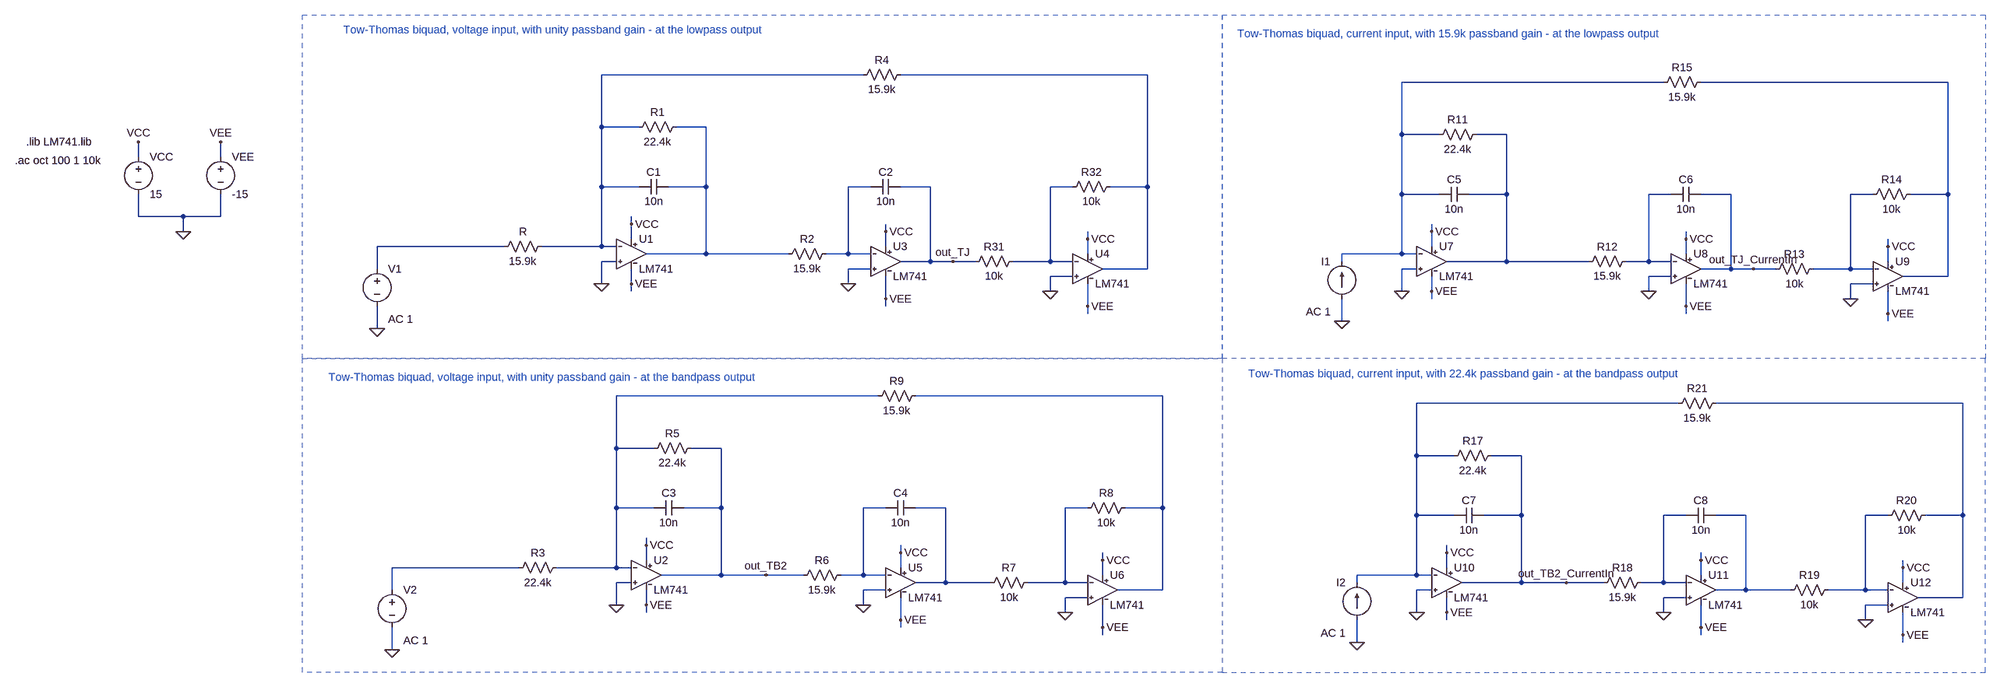
[diagram p0: schematic Filtre_Tow_Thomas.asc]
Filtre_Tow_Thomas.asc, the LTspice schematic file:
Version 4
SHEET 1 3924 1332
WIRE 1520 48 960 48
WIRE 2128 48 1600 48
WIRE 3232 64 2672 64
WIRE 3840 64 3312 64
WIRE 960 160 960 48
WIRE 1040 160 960 160
WIRE 1184 160 1120 160
WIRE 2672 176 2672 64
WIRE 2752 176 2672 176
WIRE 2896 176 2832 176
WIRE -144 224 -144 192
WIRE 32 224 32 192
WIRE 960 288 960 160
WIRE 1040 288 960 288
WIRE 1184 288 1184 160
WIRE 1184 288 1104 288
WIRE 1536 288 1488 288
WIRE 1664 288 1600 288
WIRE 1968 288 1920 288
WIRE 2128 288 2128 48
WIRE 2128 288 2048 288
WIRE 2672 304 2672 176
WIRE 2752 304 2672 304
WIRE 2896 304 2896 176
WIRE 2896 304 2816 304
WIRE 3248 304 3200 304
WIRE 3376 304 3312 304
WIRE 3680 304 3632 304
WIRE 3840 304 3840 64
WIRE 3840 304 3760 304
WIRE -144 352 -144 304
WIRE -48 352 -144 352
WIRE 32 352 32 304
WIRE 32 352 -48 352
WIRE 1024 368 1024 352
WIRE -48 384 -48 352
WIRE 1568 384 1568 368
WIRE 2736 384 2736 368
WIRE 1024 400 1024 368
WIRE 2000 400 2000 384
WIRE 3280 400 3280 384
WIRE 752 416 480 416
WIRE 960 416 960 288
WIRE 960 416 832 416
WIRE 992 416 960 416
WIRE 1568 416 1568 384
WIRE 2736 416 2736 384
WIRE 3712 416 3712 400
WIRE 1184 432 1184 288
WIRE 1184 432 1056 432
WIRE 1360 432 1184 432
WIRE 1488 432 1488 288
WIRE 1488 432 1440 432
WIRE 1536 432 1488 432
WIRE 2000 432 2000 400
WIRE 2672 432 2672 304
WIRE 2672 432 2544 432
WIRE 2704 432 2672 432
WIRE 3280 432 3280 400
WIRE 992 448 960 448
WIRE 1664 448 1664 288
WIRE 1664 448 1600 448
WIRE 1712 448 1664 448
WIRE 1760 448 1712 448
WIRE 1920 448 1920 288
WIRE 1920 448 1840 448
WIRE 1968 448 1920 448
WIRE 2544 448 2544 432
WIRE 2896 448 2896 304
WIRE 2896 448 2768 448
WIRE 3072 448 2896 448
WIRE 3200 448 3200 304
WIRE 3200 448 3152 448
WIRE 3248 448 3200 448
WIRE 3712 448 3712 416
WIRE 480 464 480 416
WIRE 1536 464 1488 464
WIRE 2128 464 2128 288
WIRE 2128 464 2032 464
WIRE 2704 464 2672 464
WIRE 3376 464 3376 304
WIRE 3376 464 3312 464
WIRE 3424 464 3376 464
WIRE 3472 464 3424 464
WIRE 3632 464 3632 304
WIRE 3632 464 3552 464
WIRE 3680 464 3632 464
WIRE 1968 480 1920 480
WIRE 3248 480 3200 480
WIRE 3840 480 3840 304
WIRE 3840 480 3744 480
WIRE 960 496 960 448
WIRE 1024 496 1024 464
WIRE 1488 496 1488 464
WIRE 3680 496 3632 496
WIRE 1024 512 1024 496
WIRE 1920 512 1920 480
WIRE 2672 512 2672 464
WIRE 2736 512 2736 480
WIRE 3200 512 3200 480
WIRE 1568 528 1568 480
WIRE 2736 528 2736 512
WIRE 3632 528 3632 496
WIRE 1568 544 1568 528
WIRE 2000 544 2000 496
WIRE 3280 544 3280 496
WIRE 2000 560 2000 544
WIRE 3280 560 3280 544
WIRE 3712 560 3712 512
WIRE 2544 576 2544 528
WIRE 3712 576 3712 560
WIRE 480 592 480 544
WIRE 1552 736 992 736
WIRE 2160 736 1632 736
WIRE 3264 752 2704 752
WIRE 3872 752 3344 752
WIRE 992 848 992 736
WIRE 1072 848 992 848
WIRE 1216 848 1152 848
WIRE 2704 864 2704 752
WIRE 2784 864 2704 864
WIRE 2928 864 2864 864
WIRE 992 976 992 848
WIRE 1072 976 992 976
WIRE 1216 976 1216 848
WIRE 1216 976 1136 976
WIRE 1568 976 1520 976
WIRE 1696 976 1632 976
WIRE 2000 976 1952 976
WIRE 2160 976 2160 736
WIRE 2160 976 2080 976
WIRE 2704 992 2704 864
WIRE 2784 992 2704 992
WIRE 2928 992 2928 864
WIRE 2928 992 2848 992
WIRE 3280 992 3232 992
WIRE 3408 992 3344 992
WIRE 3712 992 3664 992
WIRE 3872 992 3872 752
WIRE 3872 992 3792 992
WIRE 1056 1056 1056 1040
WIRE 1600 1072 1600 1056
WIRE 2768 1072 2768 1056
WIRE 1056 1088 1056 1056
WIRE 2032 1088 2032 1072
WIRE 3312 1088 3312 1072
WIRE 784 1104 512 1104
WIRE 992 1104 992 976
WIRE 992 1104 864 1104
WIRE 1024 1104 992 1104
WIRE 1600 1104 1600 1072
WIRE 2768 1104 2768 1072
WIRE 3744 1104 3744 1088
WIRE 1216 1120 1216 976
WIRE 1216 1120 1088 1120
WIRE 1312 1120 1216 1120
WIRE 1392 1120 1312 1120
WIRE 1520 1120 1520 976
WIRE 1520 1120 1472 1120
WIRE 1568 1120 1520 1120
WIRE 2032 1120 2032 1088
WIRE 2704 1120 2704 992
WIRE 2704 1120 2576 1120
WIRE 2736 1120 2704 1120
WIRE 3312 1120 3312 1088
WIRE 1024 1136 992 1136
WIRE 1696 1136 1696 976
WIRE 1696 1136 1632 1136
WIRE 1792 1136 1696 1136
WIRE 1952 1136 1952 976
WIRE 1952 1136 1872 1136
WIRE 2000 1136 1952 1136
WIRE 2576 1136 2576 1120
WIRE 2928 1136 2928 992
WIRE 2928 1136 2800 1136
WIRE 3024 1136 2928 1136
WIRE 3104 1136 3024 1136
WIRE 3232 1136 3232 992
WIRE 3232 1136 3184 1136
WIRE 3280 1136 3232 1136
WIRE 3744 1136 3744 1104
WIRE 512 1152 512 1104
WIRE 1568 1152 1520 1152
WIRE 2160 1152 2160 976
WIRE 2160 1152 2064 1152
WIRE 2736 1152 2704 1152
WIRE 3408 1152 3408 992
WIRE 3408 1152 3344 1152
WIRE 3504 1152 3408 1152
WIRE 3664 1152 3664 992
WIRE 3664 1152 3584 1152
WIRE 3712 1152 3664 1152
WIRE 2000 1168 1952 1168
WIRE 3280 1168 3232 1168
WIRE 3872 1168 3872 992
WIRE 3872 1168 3776 1168
WIRE 992 1184 992 1136
WIRE 1056 1184 1056 1152
WIRE 1520 1184 1520 1152
WIRE 3712 1184 3664 1184
WIRE 1056 1200 1056 1184
WIRE 1952 1200 1952 1168
WIRE 2704 1200 2704 1152
WIRE 2768 1200 2768 1168
WIRE 3232 1200 3232 1168
WIRE 1600 1216 1600 1168
WIRE 2768 1216 2768 1200
WIRE 3664 1216 3664 1184
WIRE 1600 1232 1600 1216
WIRE 2032 1232 2032 1184
WIRE 3312 1232 3312 1184
WIRE 2032 1248 2032 1232
WIRE 3312 1248 3312 1232
WIRE 3744 1248 3744 1200
WIRE 2576 1264 2576 1216
WIRE 3744 1264 3744 1248
WIRE 512 1280 512 1232
FLAG -144 192 VCC
FLAG 32 192 VEE
FLAG 960 496 0
FLAG 1488 496 0
FLAG 1920 512 0
FLAG 480 592 0
FLAG -48 384 0
FLAG 1024 368 VCC
FLAG 1568 384 VCC
FLAG 2000 400 VCC
FLAG 1024 496 VEE
FLAG 1568 528 VEE
FLAG 2000 544 VEE
FLAG 1712 448 out_TJ
FLAG 992 1184 0
FLAG 1520 1184 0
FLAG 1952 1200 0
FLAG 512 1280 0
FLAG 1056 1056 VCC
FLAG 1600 1072 VCC
FLAG 2032 1088 VCC
FLAG 1056 1184 VEE
FLAG 1600 1216 VEE
FLAG 2032 1232 VEE
FLAG 1312 1120 out_TB2
FLAG 2672 512 0
FLAG 3200 512 0
FLAG 3632 528 0
FLAG 2736 384 VCC
FLAG 3280 400 VCC
FLAG 3712 416 VCC
FLAG 2736 512 VEE
FLAG 3280 544 VEE
FLAG 3712 560 VEE
FLAG 3424 464 out_TJ_CurrentIn
FLAG 2704 1200 0
FLAG 3232 1200 0
FLAG 3664 1216 0
FLAG 2768 1072 VCC
FLAG 3312 1088 VCC
FLAG 3744 1104 VCC
FLAG 2768 1200 VEE
FLAG 3312 1232 VEE
FLAG 3744 1248 VEE
FLAG 3024 1136 out_TB2_CurrentIn
FLAG 2544 576 0
FLAG 2576 1264 0
SYMBOL LM741 1024 368 R0
SYMATTR InstName U1
SYMBOL voltage -144 208 R0
WINDOW 123 0 0 Left 2
WINDOW 39 0 0 Left 2
SYMATTR InstName VCC
SYMATTR Value 15
SYMBOL voltage 32 208 R0
WINDOW 123 0 0 Left 2
WINDOW 39 0 0 Left 2
SYMATTR InstName VEE
SYMATTR Value -15
SYMBOL res 848 400 R90
WINDOW 0 0 56 VBottom 2
WINDOW 3 32 56 VTop 2
SYMATTR InstName R
SYMATTR Value 15.9k
SYMBOL res 1136 144 R90
WINDOW 0 0 56 VBottom 2
WINDOW 3 32 56 VTop 2
SYMATTR InstName R1
SYMATTR Value 22.4k
SYMBOL res 1456 416 R90
WINDOW 0 0 56 VBottom 2
WINDOW 3 32 56 VTop 2
SYMATTR InstName R2
SYMATTR Value 15.9k
SYMBOL res 1856 432 R90
WINDOW 0 0 56 VBottom 2
WINDOW 3 32 56 VTop 2
SYMATTR InstName R31
SYMATTR Value 10k
SYMBOL res 2064 272 R90
WINDOW 0 0 56 VBottom 2
WINDOW 3 32 56 VTop 2
SYMATTR InstName R32
SYMATTR Value 10k
SYMBOL LM741 1568 384 R0
SYMATTR InstName U3
SYMBOL LM741 2000 400 R0
SYMATTR InstName U4
SYMBOL cap 1104 272 R90
WINDOW 0 0 32 VBottom 2
WINDOW 3 32 32 VTop 2
SYMATTR InstName C1
SYMATTR Value 10n
SYMBOL cap 1600 272 R90
WINDOW 0 0 32 VBottom 2
WINDOW 3 32 32 VTop 2
SYMATTR InstName C2
SYMATTR Value 10n
SYMBOL voltage 480 448 R0
WINDOW 123 24 124 Left 2
WINDOW 39 0 0 Left 0
SYMATTR Value2 AC 1
SYMATTR InstName V1
SYMATTR Value ""
SYMBOL res 1616 32 R90
WINDOW 0 0 56 VBottom 2
WINDOW 3 32 56 VTop 2
SYMATTR InstName R4
SYMATTR Value 15.9k
SYMBOL LM741 1056 1056 R0
SYMATTR InstName U2
SYMBOL res 880 1088 R90
WINDOW 0 0 56 VBottom 2
WINDOW 3 32 56 VTop 2
SYMATTR InstName R3
SYMATTR Value 22.4k
SYMBOL res 1168 832 R90
WINDOW 0 0 56 VBottom 2
WINDOW 3 32 56 VTop 2
SYMATTR InstName R5
SYMATTR Value 22.4k
SYMBOL res 1488 1104 R90
WINDOW 0 0 56 VBottom 2
WINDOW 3 32 56 VTop 2
SYMATTR InstName R6
SYMATTR Value 15.9k
SYMBOL res 1888 1120 R90
WINDOW 0 0 56 VBottom 2
WINDOW 3 32 56 VTop 2
SYMATTR InstName R7
SYMATTR Value 10k
SYMBOL res 2096 960 R90
WINDOW 0 0 56 VBottom 2
WINDOW 3 32 56 VTop 2
SYMATTR InstName R8
SYMATTR Value 10k
SYMBOL LM741 1600 1072 R0
SYMATTR InstName U5
SYMBOL LM741 2032 1088 R0
SYMATTR InstName U6
SYMBOL cap 1136 960 R90
WINDOW 0 0 32 VBottom 2
WINDOW 3 32 32 VTop 2
SYMATTR InstName C3
SYMATTR Value 10n
SYMBOL cap 1632 960 R90
WINDOW 0 0 32 VBottom 2
WINDOW 3 32 32 VTop 2
SYMATTR InstName C4
SYMATTR Value 10n
SYMBOL voltage 512 1136 R0
WINDOW 123 24 124 Left 2
WINDOW 39 0 0 Left 0
SYMATTR Value2 AC 1
SYMATTR InstName V2
SYMATTR Value ""
SYMBOL res 1648 720 R90
WINDOW 0 0 56 VBottom 2
WINDOW 3 32 56 VTop 2
SYMATTR InstName R9
SYMATTR Value 15.9k
SYMBOL LM741 2736 384 R0
SYMATTR InstName U7
SYMBOL res 2848 160 R90
WINDOW 0 0 56 VBottom 2
WINDOW 3 32 56 VTop 2
SYMATTR InstName R11
SYMATTR Value 22.4k
SYMBOL res 3168 432 R90
WINDOW 0 0 56 VBottom 2
WINDOW 3 32 56 VTop 2
SYMATTR InstName R12
SYMATTR Value 15.9k
SYMBOL res 3568 448 R90
WINDOW 0 0 56 VBottom 2
WINDOW 3 32 56 VTop 2
SYMATTR InstName R13
SYMATTR Value 10k
SYMBOL res 3776 288 R90
WINDOW 0 0 56 VBottom 2
WINDOW 3 32 56 VTop 2
SYMATTR InstName R14
SYMATTR Value 10k
SYMBOL LM741 3280 400 R0
SYMATTR InstName U8
SYMBOL LM741 3712 416 R0
SYMATTR InstName U9
SYMBOL cap 2816 288 R90
WINDOW 0 0 32 VBottom 2
WINDOW 3 32 32 VTop 2
SYMATTR InstName C5
SYMATTR Value 10n
SYMBOL cap 3312 288 R90
WINDOW 0 0 32 VBottom 2
WINDOW 3 32 32 VTop 2
SYMATTR InstName C6
SYMATTR Value 10n
SYMBOL res 3328 48 R90
WINDOW 0 0 56 VBottom 2
WINDOW 3 32 56 VTop 2
SYMATTR InstName R15
SYMATTR Value 15.9k
SYMBOL LM741 2768 1072 R0
SYMATTR InstName U10
SYMBOL res 2880 848 R90
WINDOW 0 0 56 VBottom 2
WINDOW 3 32 56 VTop 2
SYMATTR InstName R17
SYMATTR Value 22.4k
SYMBOL res 3200 1120 R90
WINDOW 0 0 56 VBottom 2
WINDOW 3 32 56 VTop 2
SYMATTR InstName R18
SYMATTR Value 15.9k
SYMBOL res 3600 1136 R90
WINDOW 0 0 56 VBottom 2
WINDOW 3 32 56 VTop 2
SYMATTR InstName R19
SYMATTR Value 10k
SYMBOL res 3808 976 R90
WINDOW 0 0 56 VBottom 2
WINDOW 3 32 56 VTop 2
SYMATTR InstName R20
SYMATTR Value 10k
SYMBOL LM741 3312 1088 R0
SYMATTR InstName U11
SYMBOL LM741 3744 1104 R0
SYMATTR InstName U12
SYMBOL cap 2848 976 R90
WINDOW 0 0 32 VBottom 2
WINDOW 3 32 32 VTop 2
SYMATTR InstName C7
SYMATTR Value 10n
SYMBOL cap 3344 976 R90
WINDOW 0 0 32 VBottom 2
WINDOW 3 32 32 VTop 2
SYMATTR InstName C8
SYMATTR Value 10n
SYMBOL res 3360 736 R90
WINDOW 0 0 56 VBottom 2
WINDOW 3 32 56 VTop 2
SYMATTR InstName R21
SYMATTR Value 15.9k
SYMBOL current 2544 528 R180
WINDOW 0 24 80 Left 2
WINDOW 3 24 0 Left 2
WINDOW 123 24 -28 Left 2
WINDOW 39 0 0 Left 0
SYMATTR InstName I1
SYMATTR Value ""
SYMATTR Value2 AC 1
SYMBOL current 2576 1216 R180
WINDOW 0 24 80 Left 2
WINDOW 3 24 0 Left 2
WINDOW 123 24 -28 Left 2
WINDOW 39 0 0 Left 0
SYMATTR InstName I2
SYMATTR Value ""
SYMATTR Value2 AC 1
TEXT -384 192 Left 2 !.lib LM741.lib
TEXT -408 232 Left 2 !.ac oct 100 1 10k
TEXT 408 -48 Left 2 ;Tow-Thomas biquad, voltage input, with unity passband gain - at the lowpass output
TEXT 376 696 Left 2 ;Tow-Thomas biquad, voltage input, with unity passband gain - at the bandpass output
TEXT 2320 -40 Left 2 ;Tow-Thomas biquad, current input, with 15.9k passband gain - at the lowpass output
TEXT 2344 688 Left 2 ;Tow-Thomas biquad, current input, with 22.4k passband gain - at the bandpass output
RECTANGLE Normal 2288 656 320 -80 2
RECTANGLE Normal 2288 1328 320 656 2
RECTANGLE Normal 3920 656 2288 -80 2
RECTANGLE Normal 2288 1328 3920 656 2

The netlist it stands for:
* Filtre_Tow_Thomas.asc
XU1 0 N001 VCC VEE N005 LM741  ; pins In+ In- V+ V- OUT
VCC VCC 0 15
VEE VEE 0 -15
R N001 N011 15.9k
R1 N005 N001 22.4k
R2 N007 N005 15.9k
R31 N008 out_TJ 10k
R32 N002 N008 10k
XU3 0 N007 VCC VEE out_TJ LM741  ; pins In+ In- V+ V- OUT
XU4 0 N008 VCC VEE N002 LM741  ; pins In+ In- V+ V- OUT
C1 N005 N001 10n
C2 out_TJ N007 10n
V1 N011 0 AC 1
R4 N002 N001 15.9k
XU2 0 N012 VCC VEE out_TB2 LM741  ; pins In+ In- V+ V- OUT
R3 N012 N022 22.4k
R5 out_TB2 N012 22.4k
R6 N016 out_TB2 15.9k
R7 N018 N017 10k
R8 N013 N018 10k
XU5 0 N016 VCC VEE N017 LM741  ; pins In+ In- V+ V- OUT
XU6 0 N018 VCC VEE N013 LM741  ; pins In+ In- V+ V- OUT
C3 out_TB2 N012 10n
C4 N017 N016 10n
V2 N022 0 AC 1
R9 N013 N012 15.9k
XU7 0 N003 VCC VEE N006 LM741  ; pins In+ In- V+ V- OUT
R11 N006 N003 22.4k
R12 N009 N006 15.9k
R13 N010 out_TJ_CurrentIn 10k
R14 N004 N010 10k
XU8 0 N009 VCC VEE out_TJ_CurrentIn LM741  ; pins In+ In- V+ V- OUT
XU9 0 N010 VCC VEE N004 LM741  ; pins In+ In- V+ V- OUT
C5 N006 N003 10n
C6 out_TJ_CurrentIn N009 10n
R15 N004 N003 15.9k
XU10 0 N014 VCC VEE out_TB2_CurrentIn LM741  ; pins In+ In- V+ V- OUT
R17 out_TB2_CurrentIn N014 22.4k
R18 N019 out_TB2_CurrentIn 15.9k
R19 N021 N020 10k
R20 N015 N021 10k
XU11 0 N019 VCC VEE N020 LM741  ; pins In+ In- V+ V- OUT
XU12 0 N021 VCC VEE N015 LM741  ; pins In+ In- V+ V- OUT
C7 out_TB2_CurrentIn N014 10n
C8 N020 N019 10n
R21 N015 N014 15.9k
I1 0 N003 AC 1
I2 0 N014 AC 1
.lib LM741.lib
.ac oct 100 1 10k
* Tow-Thomas biquad, voltage input, with unity passband gain - at the lowpass output
* Tow-Thomas biquad, voltage input, with unity passband gain - at the bandpass output
* Tow-Thomas biquad, current input, with 15.9k passband gain - at the lowpass output
* Tow-Thomas biquad, current input, with 22.4k passband gain - at the bandpass output
.lib LM741.lib
.backanno
.end